# Altium project LEO_COTS_rev0.PrjPcb
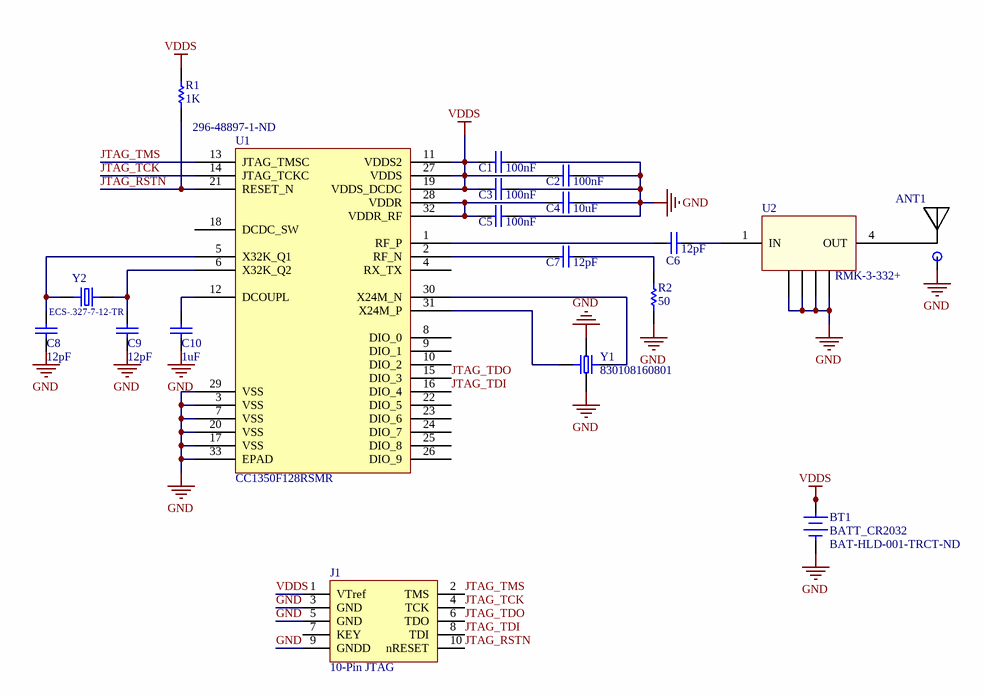
[diagram p0: LEO_COTS_rev0.SchDoc]
1 sheet, 19 parts. Net scope: global (net labels, ports and power ports of the same name join across sheets).
Board file: LEO_COTS.PcbDoc

## Sheet LEO_COTS_rev0.SchDoc: COTS LEO TX
size A; DocumentNumber: 1; Revision: 1; SheetNumber: 1; SheetTotal: 1

### Parts
ANT1  ANT  [RESLOOP_OD10_fw15_fl180_sw12_sl15]  (value not drawn)  (no BOM)
BT1  BATT_CR2032  Supplier Part Number 1: BAT-HLD-001-TRCT-ND  [BAT-HLD-001-TR]
C1  value 100nF  [CAPC0603X04N]  (hidden comment: CAP_0201)
C2  value 100nF  [CAPC0603X04N]  (hidden comment: CAP_0201)
C3  value 100nF  [CAPC0603X04N]  (hidden comment: CAP_0201)
C4  value 10uF  [CAPC1608X05N]  (hidden comment: CAP_0603)
C5  value 100nF  [CAPC0603X04N]  (hidden comment: CAP_0201)
C6  value 12pF  [1608[0603]]  (hidden comment: CAP)
C7  value 12pF  [CAPC0603X04N]  (hidden comment: CAP_0201)
C8  value 12pF  [CAPC0603X04N]  (hidden comment: CAP_0201)
C9  value 12pF  [CAPC0603X04N]  (hidden comment: CAP_0201)
C10  value 1uF  [CAPC0603X04N]  (hidden comment: CAP_0201)
J1  10-Pin JTAG  [FTSH-105-01-F-DV-007-K]
R1  value 1K  [CAPC0603X04N]  (hidden comment: RES_0201)
R2  value 50  [CAPC0603X04N]  (hidden comment: RES_0201)
U1  CC1350F128RSMR  Supplier Part Number 1: 296-48897-1-ND  [QFN40P400X400X100-33N]
U2  RMK-3-332+  [RMK-3-331+]
Y1  830108160801  [LFXTAL081608]
Y2  ECS-.327-7-12-TR  [XTAL_ECS-.327-7-12-TR]

### Nets
GND: ANT1.2(-) BT1.N1(-) C1.1 C2.1 C3.1 C4.2 C5.1 C8.1 C9.1 C10.1 J1.3(GND) J1.5(GND) J1.9(GNDD) R2.1 U1.3(VSS) U1.7(VSS) U1.17(VSS) U1.20(VSS) U1.29(VSS) U1.33(EPAD) U2.2 U2.3 U2.5 U2.6 Y1.2 Y1.4
VDDS: BT1.P1(+) BT1.P2(+) C1.2 C2.2 C3.2 J1.1(VTref) R1.2 U1.11(VDDS2) U1.19(VDDS_DCDC) U1.27(VDDS)
JTAG_RSTN: J1.10(nRESET) R1.1 U1.21(RESET_N)
JTAG_TCK: J1.4(TCK) U1.14(JTAG_TCKC)
JTAG_TDI: J1.8(TDI) U1.16(DIO_4)
JTAG_TDO: J1.6(TDO) U1.15(DIO_3)
JTAG_TMS: J1.2(TMS) U1.13(JTAG_TMSC)
NetANT1_1: ANT1.1(+) U2.4(OUT)
NetC4_1: C4.1 C5.2 U1.28(VDDR) U1.32(VDDR_RF)
NetC6_1: C6.1 U1.1(RF_P)
NetC6_2: C6.2 U2.1(IN)
NetC7_1: C7.1 R2.2
NetC7_2: C7.2 U1.2(RF_N)
NetC8_2: C8.2 U1.5(X32K_Q1) Y2.1
NetC9_2: C9.2 U1.6(X32K_Q2) Y2.2
NetC10_2: C10.2 U1.12(DCOUPL)
NetU1_30: U1.30(X24M_N) Y1.3
NetU1_31: U1.31(X24M_P) Y1.1

Not connected (* = marked no-connect by the designer): J1 7(KEY); U1 4(RX_TX) 8(DIO_0) 9(DIO_1) 10(DIO_2) 18(DCDC_SW) 22(DIO_5) 23(DIO_6) 24(DIO_7) 25(DIO_8) 26(DIO_9)

### Notes on the sheet
- Title
- Size:
- Date:
- A
- Number:
- Time:
- Revision:
- Sheet
- of
- File:

### Library data of the parts
ANT1 = ANT: PCB antenna
BT1 = BATT_CR2032: CR2032 Battery Holder; Supplier 1: Digi-Key
C1-C3 C5 = CAP_0201: CAP CER 100nF 0201; Supplier 1: Digi-Key; Supplier Part Number 1: 490-5881-1-ND
C4 = CAP_0603: CAP CER 10uF 0603
C6 = CAP: CAP CER 12pF 0603
C7-C9 = CAP_0201: CAP CER 12pF 0201
C10 = CAP_0201: CAP CER 1uF 0201
J1 = CM10: Supplier 1: Digi-Key; Supplier Part Number 1: FTSH-105-01-L-DV-007-K-P-ND
R1 = Res Semi: RES 1K OHM 0201; Published: 8-Jun-2000; LatestRevisionDate: 17-Jul-2002; LatestRevisionNote: Re-released for DXP Platform.; PackageReference: AXIAL-0.5; Publisher: Altium Limited; PackageDescription: Axial Device, Thru-Hole; 2 Leads; 0.5 in Pin Spacing
R2 = Res Semi: RES 50 OHM 0201; Published: 8-Jun-2000; LatestRevisionDate: 17-Jul-2002; LatestRevisionNote: Re-released for DXP Platform.; PackageReference: AXIAL-0.5; Publisher: Altium Limited; PackageDescription: Axial Device, Thru-Hole; 2 Leads; 0.5 in Pin Spacing
U1 = CC1350F128RSMR: Ultra-Low-Power Dual-Band Wireless MCU; Supplier 1: Digi-Key
U2 = RMK-3-332+: 3x Frequency Multiplier
Y1 = 830108160801: 24 MHz crystal; MP: ECS-.327-7-12-TR; Package: None; Price: None; Value: *; Availability: Unavailable
Y2 = ECS-.327-7-12-TR: 32.768 kHz SMD Crystal; Package: None; Price: None; Value: *; MP: ECS-.327-7-12-TR; Availability: Unavailable

## Assembly variants
LEO_COTS_rev0 (no batt holder): not fitted BT1